# EAGLE design coil_adapter (EAGLE 7.1.0)
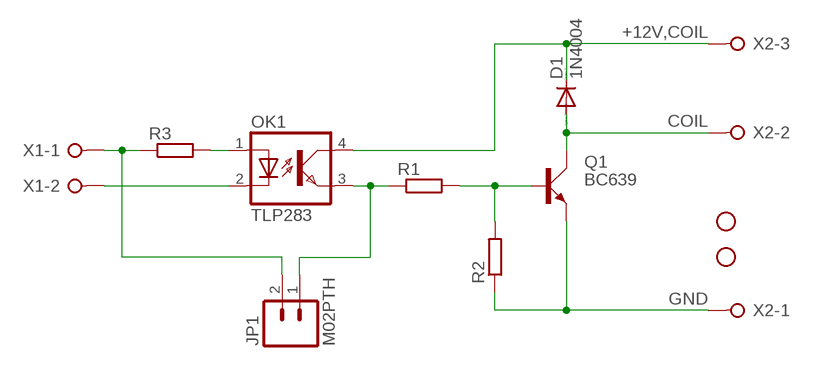
[diagram p0: schematic, sheet 1]

## Parts
D1  1N4004  [DO41-10]
JP1  M02PTH  [1X02]
OK1  TLP283  [MINI-FLAT-4]
Q1  BC639  [SOT54D]
R1  R-EU_R1206  [R1206]
R2  R-EU_R1206  [R1206]
R3  R-EU_R1206  [R1206]
STANDOFF1  STAND-OFF  [STAND-OFF]
STANDOFF2  STAND-OFF  [STAND-OFF]
X1  W237-02P  [W237-132]
X2  W237-03P  [W237-133]

## Nets
+12V,COIL: D1.C OK1.4(COL) X2.3
COIL: D1.A Q1.C X2.2
GND: Q1.E R2.1 X2.1
N$1: Q1.B R1.2 R2.2
N$5: JP1.1 OK1.3(EMIT) R1.1
N$6: JP1.2 R3.1 X1.1
N$7: OK1.1(A) R3.2
N$9: OK1.2(C) X1.2

## Library data of the parts
D1 = diode:1N4004: DIODE general purpose rectifier, 1 A
JP1 = SparkFun-Connectors:M02: Standard 2-pin 0.1" header. Use with - straight break away headers ( PRT-00116) - right angle break away headers (PRT-00553) - swiss pins (PRT-00743) - machine pins (PRT-00117) - female headers (PRT-00115) Molex polarized connector foot print use with: PRT-08233 with associated crimp pins and housings. 2.54_SCREWTERM for use with PRT-10571. 3.5mm Screw Terminal footprints for PRT-08084 5mm Screw Terminal footprints for use with PRT-08432
OK1 = optocoupler:TLP283: TOSHIBA PHOTOCOUPLER GaAs IRED & PHOTO-TRANSISTOR Source: http://www.semicon.toshiba.co.jp/td/en/Opto/Photocoupler/en_20050928_TLP283_datasheet.pdf; OC_FARNELL: unknown; OC_NEWARK: unknown
Q1 = transistor-small-signal:BC639: NPN TRANSISTOR
R1-R3 = rcl:R-EU_: RESISTOR, European symbol
STANDOFF1 STANDOFF2 = SparkFun-Electromechanical:STAND-OFF: #4 Stand Off This is the mechanical footprint for a #4 phillips button head screw. Use the keepout ring to avoid running the screw head into surrounding components. SKU : PRT-00447
X1 = con-wago-508:W237-02P: WAGO SREW CLAMP; OC_FARNELL: unknown; OC_NEWARK: unknown
X2 = con-wago-508:W237-03P: WAGO SREW CLAMP; OC_FARNELL: unknown; OC_NEWARK: unknown

## Board
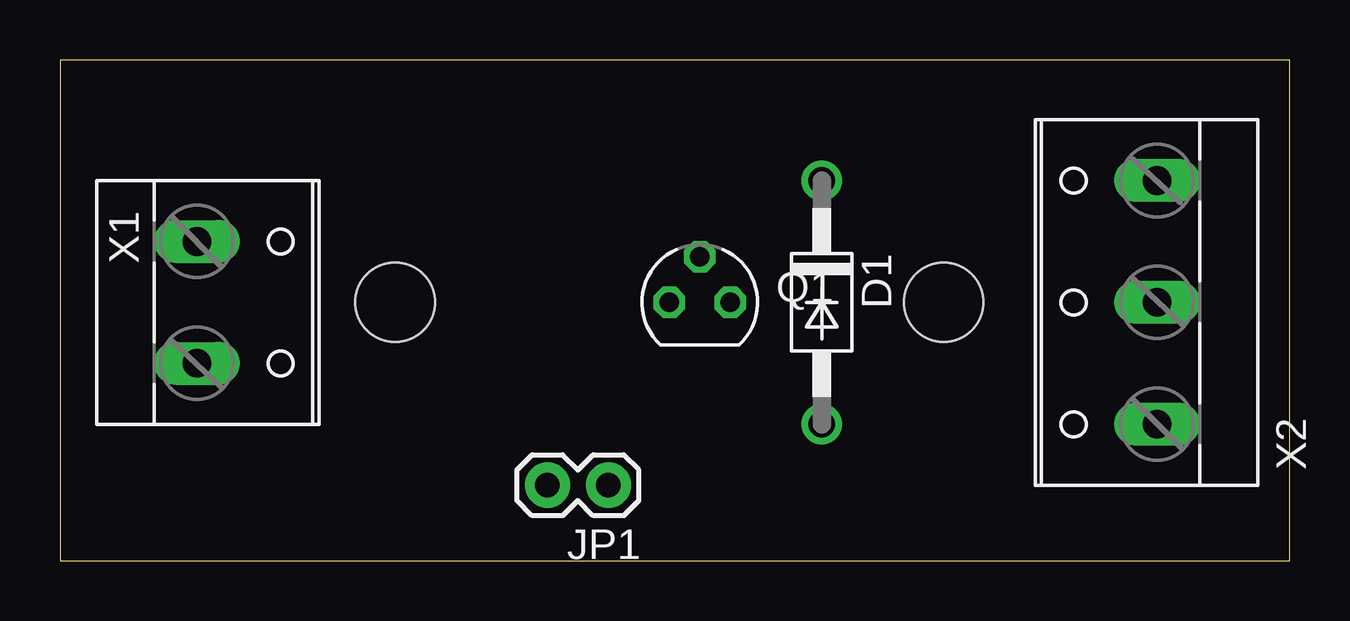
[diagram p1: board, top side]
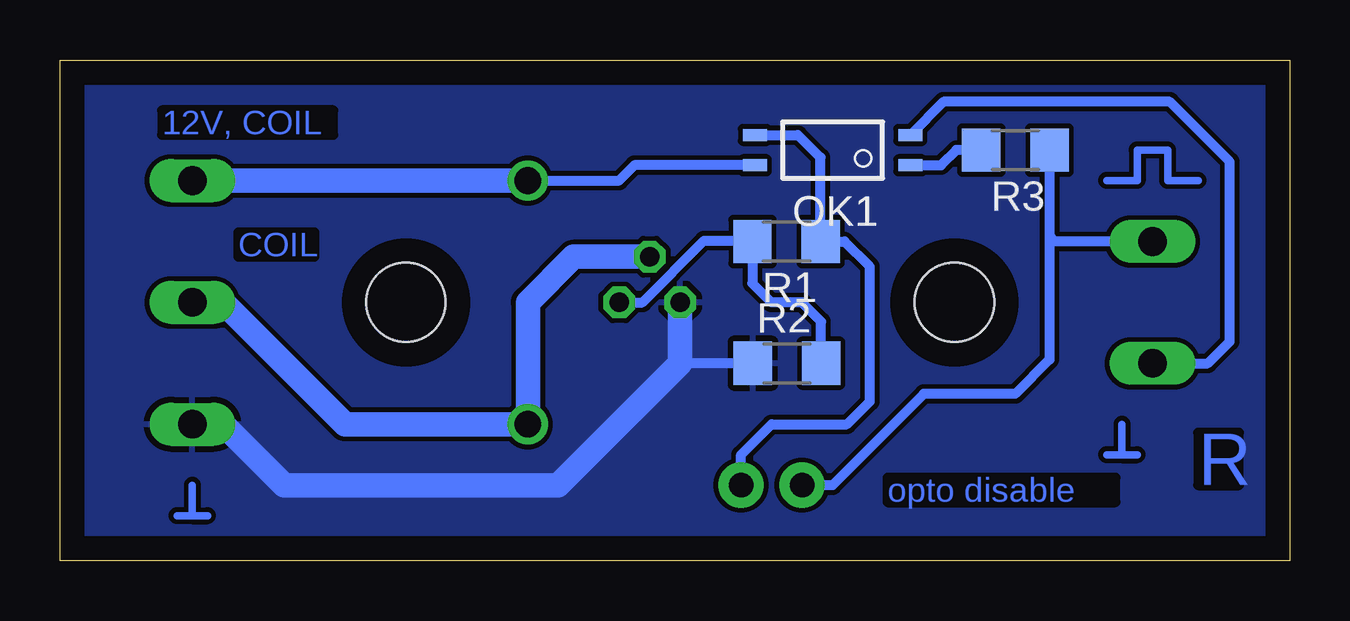
[diagram p2: board, bottom side, seen from below]

Size 51.25 x 20.9 mm. Coordinates in mm from the lower left corner, seen from the top.
Outline: 0,0 51.25,0 51.25,20.9 0,20.9 0,0
Copper layers (1*16): Top 0.035mm / dielectric 1.5mm / Bottom 0.035mm
Design rules "default": minimum track width 10mil, minimum drill 24mil, track to track 8mil, track to pad 8mil, pad to pad 8mil, via to via 8mil, smd to smd 8mil, copper to edge 40mil, drill to drill 8mil, minimum pad ring 10mil, minimum via ring 8mil, stop-mask expansion 4mil, vias tented up to drill 0mil, thermal gap 10mil

### Footprints (pad centres in the part's own frame; a part is rotated, then mirrored left to right if it is on the bottom)
DO41-10 = drill 1.118: A 5.08,0; C -5.08,0
1X02 = drill 1.016 pad 1.88: 1 0,0; 2 2.54,0
MINI-FLAT-4 = smd 1 x 0.5: 1 -3.24,0.635; 2 -3.24,-0.635; 3 3.24,-0.635; 4 3.24,0.635
SOT54D = drill 0.813 octagon: B 1.27,0; C 0,1.905; E -1.27,0
R1206 = smd 1.6 x 1.803: 1 -1.422,0; 2 1.422,0
STAND-OFF = hole 3.302: 0,0
W237-132 = drill 1.194 long: 1 -2.54,-0.635; 2 2.54,-0.635
W237-133 = drill 1.194 long: 1 -5.08,-0.635; 2 0,-0.635; 3 5.08,-0.635

### Placement (x,y rotation side)
D1  31.75,10.78 270 top
JP1  22.86,3.17 180 top
OK1  19.05,17.13 180 bottom
Q1  26.67,10.78 0 top
R1  20.96,13.33 180 bottom
R2  20.95,8.24 0 bottom
R3  11.43,17.13 180 bottom
STANDOFF1  36.83,10.78 0 top
STANDOFF2  13.97,10.78 0 top
X1  6.35,10.78 270 top
X2  45.09,10.78 90 top

### Tracks (layer width: path | path; a pad name or v marks a point on that pad's centre or on a via)
+12V,COIL
  Bottom 0.406: OK1.4 27.3,16.5 27.94,15.87 D1.C
  Bottom 1.016: X2.3 D1.C
COIL
  Bottom 1.016: Q1.C 29.84,12.69 31.75,10.78 D1.A 39.37,5.71 44.45,10.78 X2.2
GND
  Bottom 0.406: R2.1 25.4,8.24
  Bottom 1.016: Q1.E 25.4,8.24 30.48,3.17 41.91,3.17 44.45,5.71 X2.1
  pour Bottom: -1.27,23.48 53.34,23.48 53.34,-1.92 -1.27,-1.92
N$1
  Bottom 0.406: R2.2 19.52,9.99 20.32,10.78 21.59,10.78 22.39,11.58 R1.2 22.42,13.35 24.4,13.35 26.97,10.78 Q1.B
N$2
  Bottom 0.305: 3.81,15.87 5.08,15.87 5.08,17.13 6.35,17.13 6.35,15.87 7.62,15.87
N$3
  Bottom 0.305: 6.99,5.71 6.99,4.44 | 6.99,4.44 6.35,4.44 | 6.99,4.44 7.62,4.44
N$4
  Bottom 0.305: 45.73,3.17 45.73,1.89 | 45.73,1.89 45.09,1.89 | 45.73,1.89 46.37,1.89
N$5
  Bottom 0.406: JP1.1 22.86,4.44 21.59,5.71 18.45,5.71 17.5,6.65 17.5,12.28 18.55,13.33 R1.1 19.54,16.82 20.49,17.77 OK1.3
N$6
  Bottom 0.406: X1.1 9.79,13.33 10,13.53 R3.1 10.01,8.4 11.43,6.97 15.24,6.97 19.05,3.17 JP1.2
N$7
  Bottom 0.406: R3.2 13.89,17.13 14.53,16.5 OK1.1
N$9
  Bottom 0.406: X1.2 3.41,8.24 2.5,9.15 2.5,16.66 5,19.16 14.43,19.16 OK1.2

### Text on the board
Bottom: 12V, COIL | COIL | R | opto disable